# EAGLE design Fan-Module (EAGLE 8.7.0)
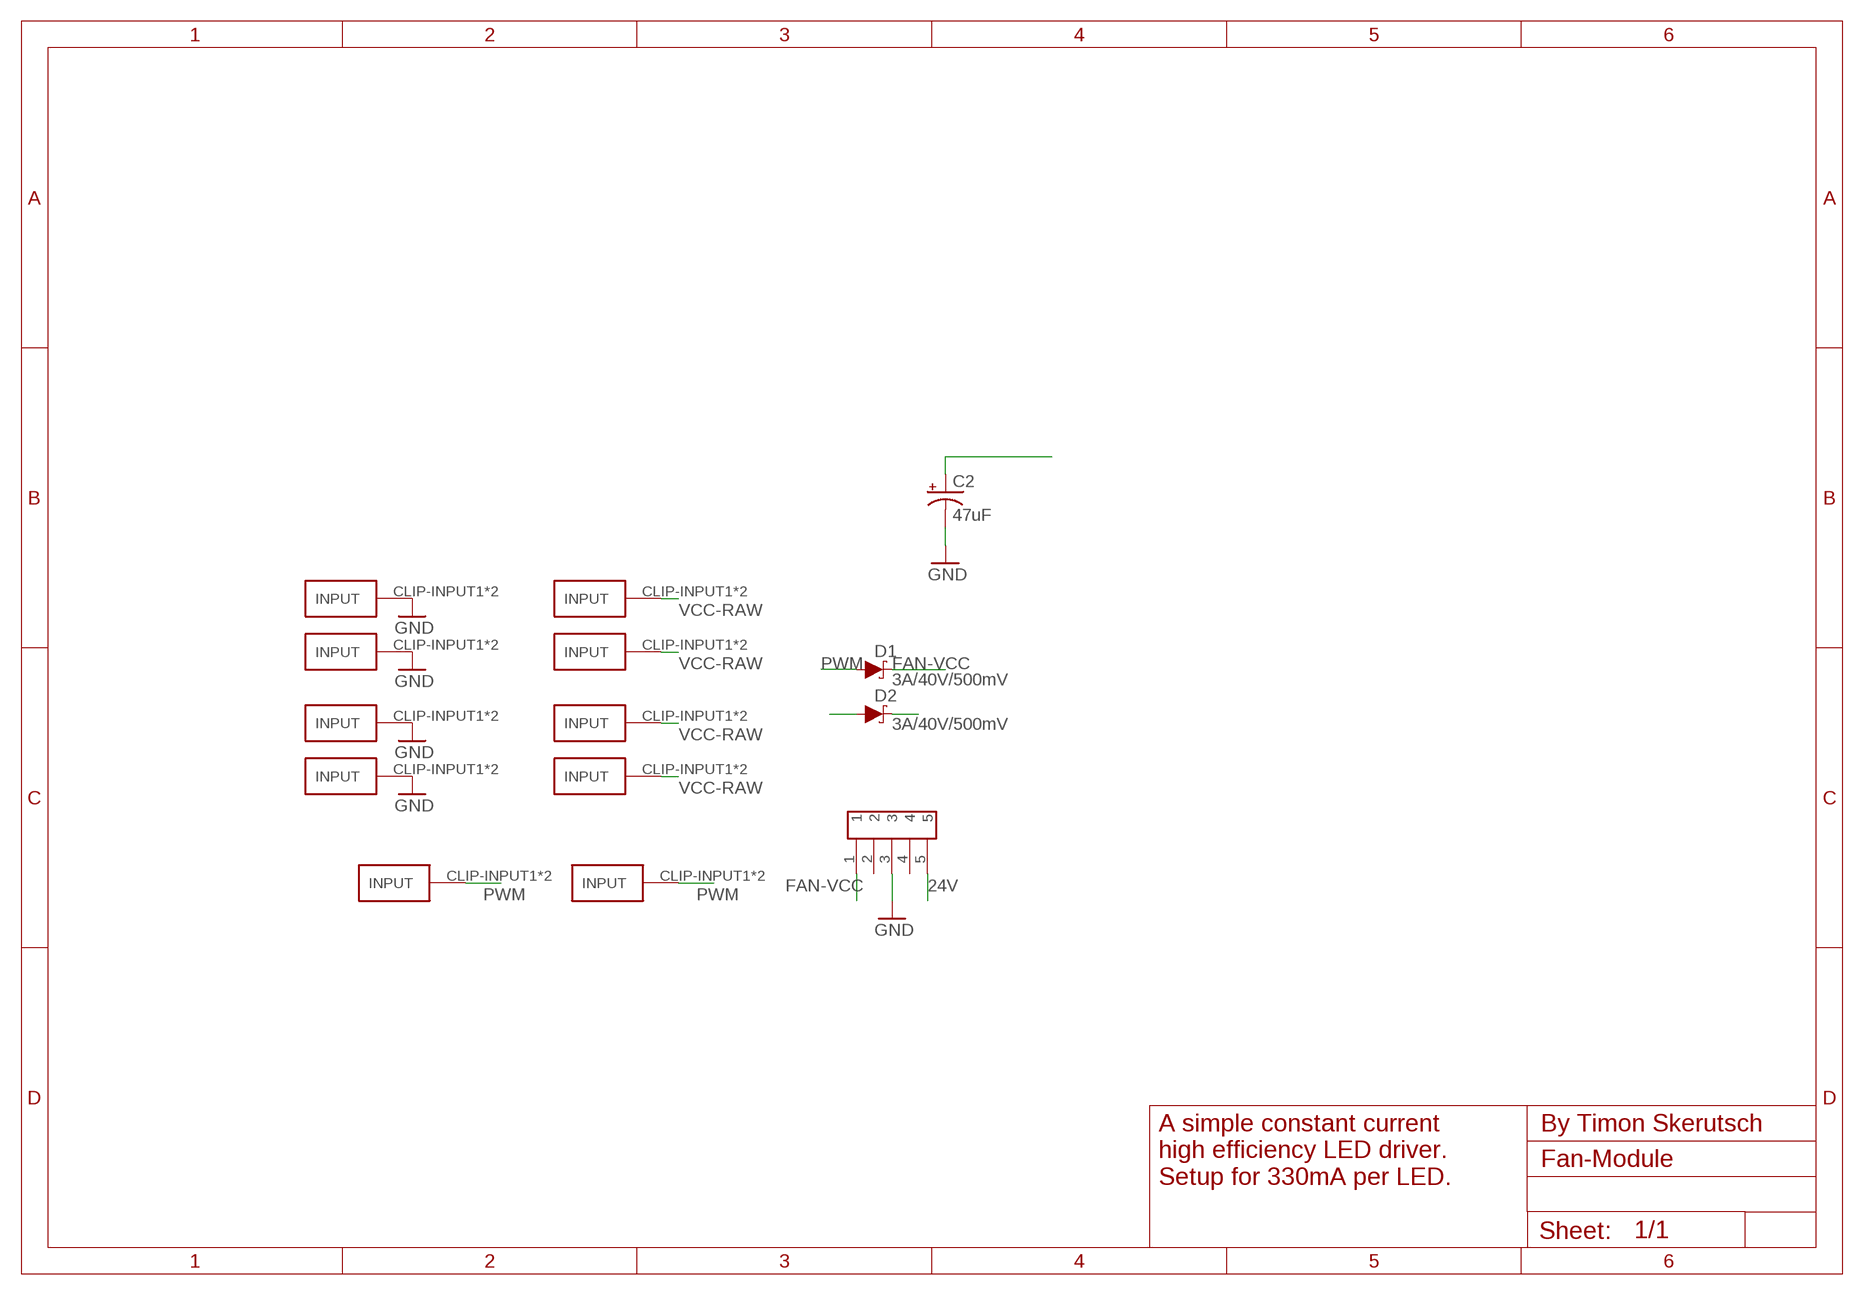
[diagram p0: schematic, sheet 1]

## Parts
C2  47uF  47UF-POLAR-PANASONIC_D-35V-20%  [PANASONIC_D]
D1  3A/40V/500mV  DIODE-SCHOTTKY-B340A  [SMA-DIODE]
D2  3A/40V/500mV  DIODE-SCHOTTKY-B340A  [SMA-DIODE]
GND-CLIP  FUSE-HOLDER-5X20MM  [FUSE-HOLDER-5X20MM]
GND-CLIP1  FUSE-HOLDER-5X20MM  [FUSE-HOLDER-5X20MM]
GND-CLIP2  FUSE-HOLDER-5X20MM  [FUSE-HOLDER-5X20MM]
GND-CLIP3  FUSE-HOLDER-5X20MM  [FUSE-HOLDER-5X20MM]
PWM-CLIP  FUSE-HOLDER-5X20MM  [FUSE-HOLDER-5X20MM]
PWM-CLIP1  FUSE-HOLDER-5X20MM  [FUSE-HOLDER-5X20MM]
U$2  M20-8900505  [M20-8900505]
VCC-CLIP  FUSE-HOLDER-5X20MM  [FUSE-HOLDER-5X20MM]
VCC-CLIP1  FUSE-HOLDER-5X20MM  [FUSE-HOLDER-5X20MM]
VCC-CLIP2  FUSE-HOLDER-5X20MM  [FUSE-HOLDER-5X20MM]
VCC-CLIP3  FUSE-HOLDER-5X20MM  [FUSE-HOLDER-5X20MM]

## Nets
24V [VCC]: D2.C U$2.5
FAN-VCC: C2.+ D1.C U$2.1
GND: C2.- GND-CLIP1.CLIP-INPUT1(INPUT) GND-CLIP1.CLIP-INPUT2(INPUT) GND-CLIP2.CLIP-INPUT1(INPUT) GND-CLIP2.CLIP-INPUT2(INPUT) GND-CLIP3.CLIP-INPUT1(INPUT) GND-CLIP3.CLIP-INPUT2(INPUT) GND-CLIP.CLIP-INPUT1(INPUT) GND-CLIP.CLIP-INPUT2(INPUT) U$2.3
PWM: D1.A PWM-CLIP1.CLIP-INPUT1(INPUT) PWM-CLIP1.CLIP-INPUT2(INPUT) PWM-CLIP.CLIP-INPUT1(INPUT) PWM-CLIP.CLIP-INPUT2(INPUT)
VCC-RAW [VCC]: D2.A VCC-CLIP1.CLIP-INPUT1(INPUT) VCC-CLIP1.CLIP-INPUT2(INPUT) VCC-CLIP2.CLIP-INPUT1(INPUT) VCC-CLIP2.CLIP-INPUT2(INPUT) VCC-CLIP3.CLIP-INPUT1(INPUT) VCC-CLIP3.CLIP-INPUT2(INPUT) VCC-CLIP.CLIP-INPUT1(INPUT) VCC-CLIP.CLIP-INPUT2(INPUT)
Unconnected: U$2.2 U$2.4

## Notes on the sheet
- By Timon Skerutsch
- A simple constant current
  high efficiency LED driver.
  Setup for 330mA per LED.

## Library data of the parts
C2 = SparkFun-Capacitors:47UF-POLAR: 47µF polarized capacitors A capacitor is a passive two-terminal electrical component used to store electrical energy temporarily in an electric field.; PROD_ID: CAP-08478
D1 D2 = SparkFun-DiscreteSemi:DIODE-SCHOTTKY: Schottky diode A Schottky diode is a semiconductor diode which has a low forward voltage drop and a very fast switching action.; PROD_ID: DIO-09886
GND-CLIP GND-CLIP1-GND-CLIP3 PWM-CLIP PWM-CLIP1 VCC-CLIP VCC-CLIP1-VCC-CLIP3 = timon-diverses:FUSE-HOLDER-5X20MM
U$2 = MESO:M20-8900505

## Net classes
1 VCC: clearance 0.508 mm

## Board
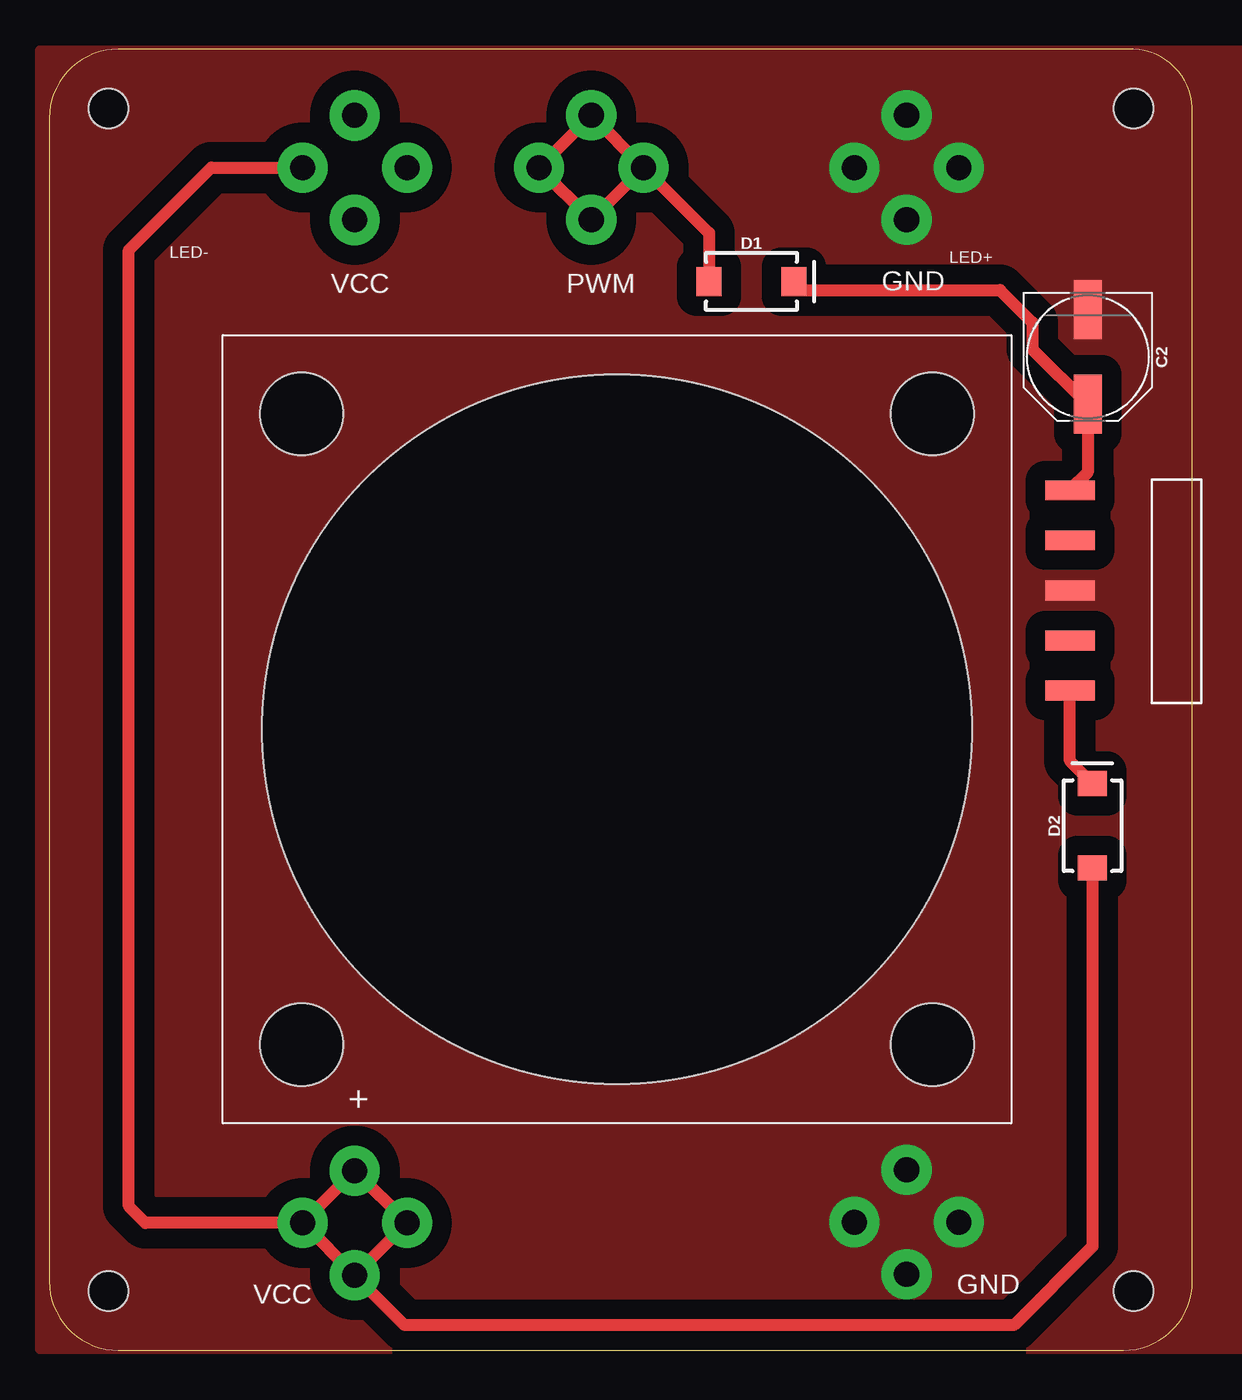
[diagram p1: board, top side]
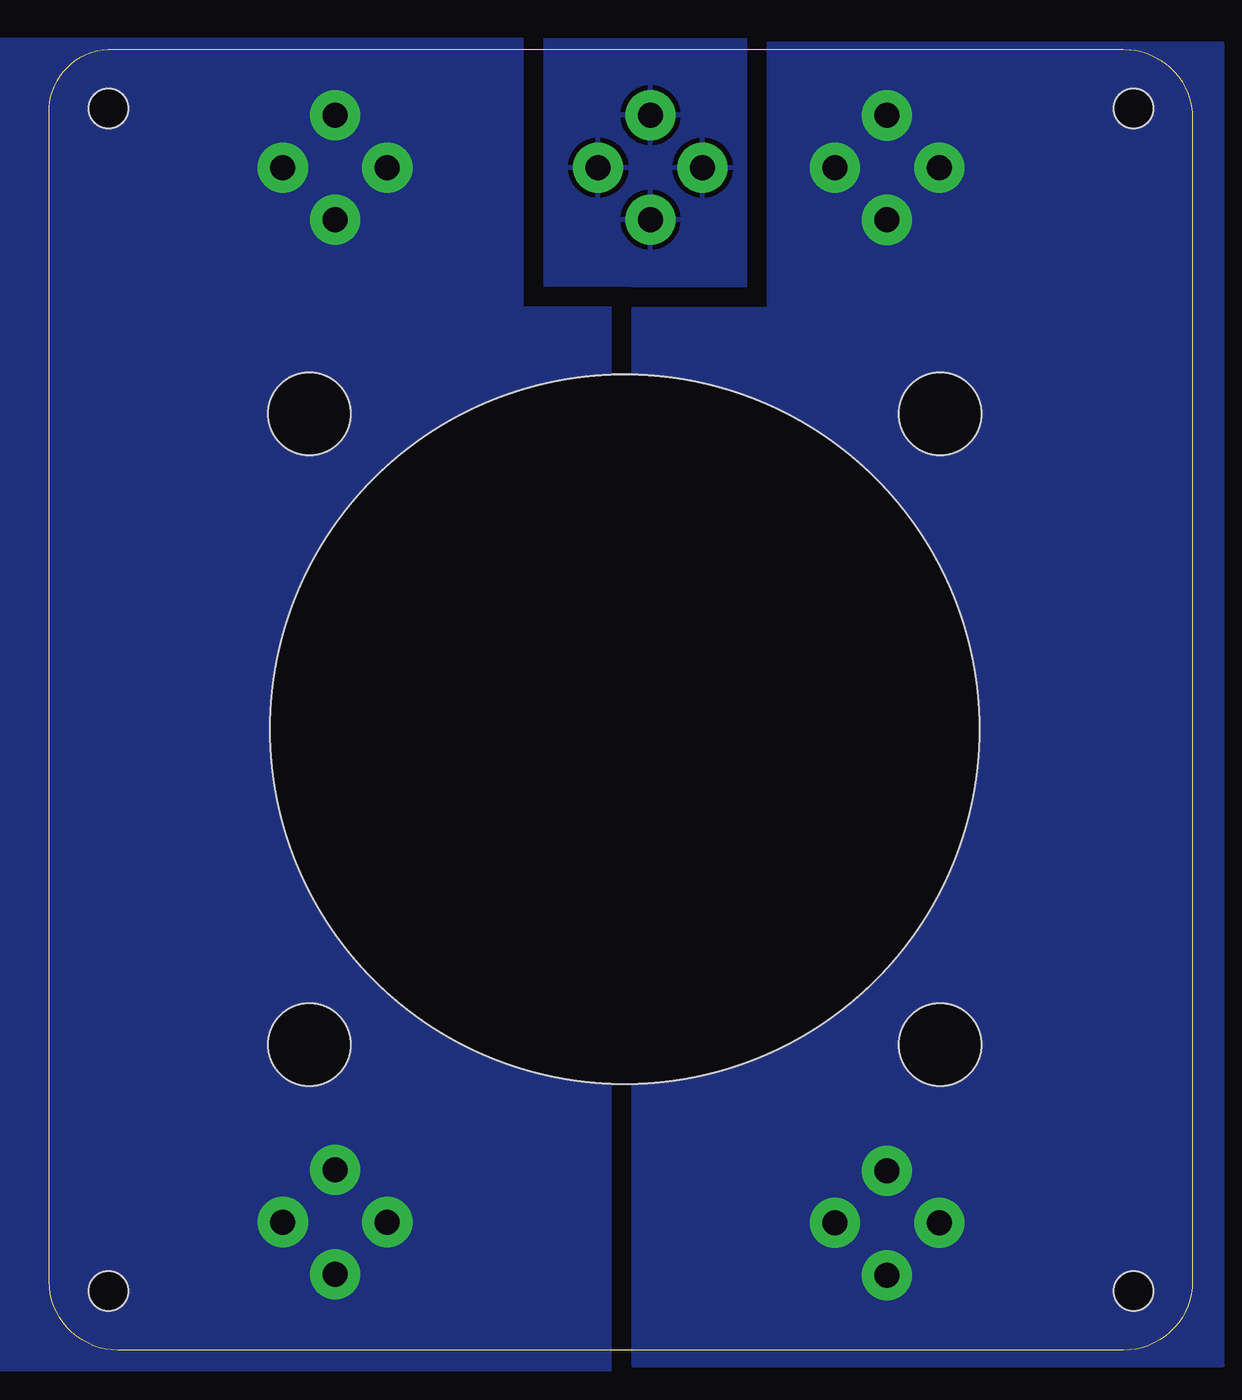
[diagram p2: board, bottom side, seen from below]

Size 58 x 66 mm. Coordinates in mm from the lower left corner, seen from the top.
Outline: 54.5,0 arc90 58,3.5 58,62.75 arc90 55.01,66 3.5,66 arc90 0,62.5 0,3.5 arc90 3.5,0 54.5,0
Copper layers (1*16): Top 0.035mm / dielectric 1.5mm / Bottom 0.035mm
Design rules "led_module *": minimum track width 8mil, minimum drill 1mm, track to track 1mm, track to pad 1mm, pad to pad 1mm, via to via 1mm, smd to smd 0mil, copper to edge 0mil, drill to drill 1mil, minimum pad ring 10mil, minimum via ring 10mil, stop-mask expansion 1mil, vias tented up to drill 30mil, thermal gap 10mil
Holes 2 mm at 3,63 55,63 3,3 55,3

### Footprints (pad centres in the part's own frame; a part is rotated, then mirrored left to right if it is on the bottom)
PANASONIC_D = smd 3 x 1.4: + 2.4,0; - -2.4,0
SMA-DIODE = smd 1.27 x 1.47: A -2.15,0; C 2.15,0
FUSE-HOLDER-5X20MM = drill 1.27 pad 2.54: CLIP-INPUT1 -2.65,0; CLIP-INPUT2 2.65,0
40MM-FAN = hole 36: 0,0 | hole 4.2: -16,16; 16,16; 16,-16; -16,-16
M20-8900505 = smd 1 x 2.5: 1 -5.08,-2.54; 2 -2.54,-2.54; 3 0,-2.54; 4 2.54,-2.54; 5 5.08,-2.54

### Placement (x,y rotation side)
C2  52.69,50.39 270 top
D1  35.62,54.22 0 top
D2  52.93,26.61 90 top
GND-CLIP  43.5,60 0 top
GND-CLIP1  43.5,6.5 90 top
GND-CLIP2  43.5,6.5 0 top
GND-CLIP3  43.5,60 90 top
PWM-CLIP  27.5,60 0 top
PWM-CLIP1  27.5,60 90 top
U$1  [40MM-FAN]  28.8,31.5 0 top
U$2  54.33,38.55 270 top
VCC-CLIP  15.5,60 0 top
VCC-CLIP1  15.5,6.46 90 top
VCC-CLIP2  15.5,6.46 0 top
VCC-CLIP3  15.5,59.99 270 bottom

### Tracks (layer width: path | path; a pad name or v marks a point on that pad's centre or on a via)
24V
  Top 0.61: D2.C 51.78,29.9 U$2.5
FAN-VCC
  Top 0.61: D1.C 38.21,53.78 48.23,53.78 49.88,52.13 49.88,50.8 C2.+ 52.69,44.53 U$2.1
GND
  pour Top (rank 2, no thermals): -0.5,66 60.5,66 60.5,0 -0.5,0
  pour Bottom (rank 2, no thermals): 29,52.87 34,52.87 34,66.5 61.5,66.5 61.5,-1 29,-1
PWM
  Top 0.61: PWM-CLIP.CLIP-INPUT2 33.47,56.68 D1.A | PWM-CLIP.CLIP-INPUT2 PWM-CLIP1.CLIP-INPUT1 PWM-CLIP.CLIP-INPUT1 PWM-CLIP1.CLIP-INPUT2 PWM-CLIP.CLIP-INPUT2
  pour Bottom (rank 3): 22.13,66.5 22.13,53.5 33.37,53.5 33.37,66.5
VCC-RAW
  Top 0.61: D2.A 52.93,5.27 48.93,1.27 18.04,1.27 VCC-CLIP1.CLIP-INPUT1 | VCC-CLIP1.CLIP-INPUT1 VCC-CLIP2.CLIP-INPUT2 VCC-CLIP1.CLIP-INPUT2 VCC-CLIP2.CLIP-INPUT1 | VCC-CLIP2.CLIP-INPUT1 VCC-CLIP1.CLIP-INPUT1 | VCC-CLIP2.CLIP-INPUT1 4.88,6.46 4.03,7.3 4.03,55.82 8.22,60 VCC-CLIP.CLIP-INPUT1
  pour Bottom (no thermals): -1.53,66.34 -1.53,-0.81 28.38,-0.81 28.38,52.88 21.52,52.88 21.52,66.34

### Text on the board
tPlace: +
tNames: LED- | LED+ | VCC | PWM | GND | GND | VCC